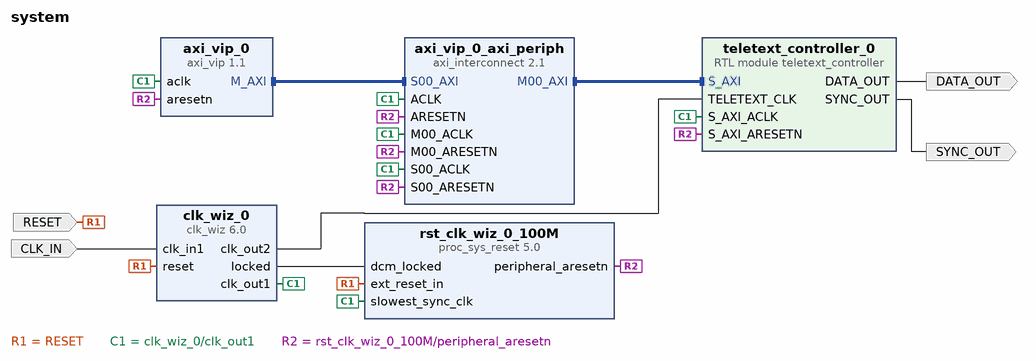
[diagram p0: block diagram of the top level]
# Vivado block design system, xc7a35tcpg236-1, Vivado 2022.2.2
create_bd_design system

create_bd_port -dir I RESET
create_bd_port -dir O -type data DATA_OUT
create_bd_port -dir O -type data SYNC_OUT
create_bd_port -dir I -type clk CLK_IN
set_property -dict {CONFIG.FREQ_HZ 100000000} [get_bd_ports CLK_IN]

create_bd_cell -type ip -vlnv xilinx.com:ip:clk_wiz:6.0 clk_wiz_0
set_property -dict [list \
  CONFIG.CLKOUT1_JITTER 135.375 \
  CONFIG.CLKOUT1_PHASE_ERROR 105.692 \
  CONFIG.CLKOUT1_REQUESTED_OUT_FREQ 100 \
  CONFIG.CLKOUT2_JITTER 231.359 \
  CONFIG.CLKOUT2_PHASE_ERROR 105.692 \
  CONFIG.CLKOUT2_REQUESTED_OUT_FREQ 6.9375 \
  CONFIG.CLKOUT2_USED true \
  CONFIG.MMCM_CLKFBOUT_MULT_F 8.875 \
  CONFIG.MMCM_CLKIN1_PERIOD 10.000 \
  CONFIG.MMCM_CLKIN2_PERIOD 10.000 \
  CONFIG.MMCM_CLKOUT0_DIVIDE_F 8.875 \
  CONFIG.MMCM_CLKOUT1_DIVIDE 128 \
  CONFIG.MMCM_DIVCLK_DIVIDE 1 \
  CONFIG.NUM_OUT_CLKS 2 \
] [get_bd_cells clk_wiz_0]
create_bd_cell -type ip -vlnv xilinx.com:ip:axi_vip:1.1 axi_vip_0
set_property -dict [list \
  CONFIG.ADDR_WIDTH 32 \
  CONFIG.DATA_WIDTH 32 \
  CONFIG.HAS_BRESP 1 \
  CONFIG.HAS_PROT 1 \
  CONFIG.HAS_RRESP 0 \
  CONFIG.HAS_WSTRB 1 \
  CONFIG.INTERFACE_MODE MASTER \
  CONFIG.PROTOCOL AXI4LITE \
  CONFIG.READ_WRITE_MODE READ_WRITE \
] [get_bd_cells axi_vip_0]
create_bd_cell -type ip -vlnv xilinx.com:ip:axi_interconnect:2.1 axi_vip_0_axi_periph
set_property -dict {CONFIG.NUM_MI 1} [get_bd_cells axi_vip_0_axi_periph]
create_bd_cell -type ip -vlnv xilinx.com:ip:proc_sys_reset:5.0 rst_clk_wiz_0_100M
create_bd_cell -type module -reference teletext_controller teletext_controller_0

# ---- connections ----

connect_bd_intf_net [get_bd_intf_pins axi_vip_0/M_AXI] [get_bd_intf_pins axi_vip_0_axi_periph/S00_AXI]
connect_bd_intf_net [get_bd_intf_pins axi_vip_0_axi_periph/M00_AXI] [get_bd_intf_pins teletext_controller_0/S_AXI]
connect_bd_net [get_bd_ports CLK_IN] [get_bd_pins clk_wiz_0/clk_in1]
connect_bd_net [get_bd_ports RESET] [get_bd_pins clk_wiz_0/reset] [get_bd_pins rst_clk_wiz_0_100M/ext_reset_in]
connect_bd_net [get_bd_pins clk_wiz_0/clk_out1] \
  [get_bd_pins axi_vip_0/aclk] [get_bd_pins axi_vip_0_axi_periph/ACLK] [get_bd_pins axi_vip_0_axi_periph/S00_ACLK] \
  [get_bd_pins rst_clk_wiz_0_100M/slowest_sync_clk] [get_bd_pins axi_vip_0_axi_periph/M00_ACLK] \
  [get_bd_pins teletext_controller_0/S_AXI_ACLK]
connect_bd_net [get_bd_pins clk_wiz_0/clk_out2] [get_bd_pins teletext_controller_0/TELETEXT_CLK]
connect_bd_net [get_bd_pins clk_wiz_0/locked] [get_bd_pins rst_clk_wiz_0_100M/dcm_locked]
connect_bd_net [get_bd_pins rst_clk_wiz_0_100M/peripheral_aresetn] \
  [get_bd_pins axi_vip_0_axi_periph/S00_ARESETN] [get_bd_pins axi_vip_0_axi_periph/M00_ARESETN] \
  [get_bd_pins axi_vip_0_axi_periph/ARESETN] [get_bd_pins axi_vip_0/aresetn] \
  [get_bd_pins teletext_controller_0/S_AXI_ARESETN]
connect_bd_net [get_bd_pins teletext_controller_0/DATA_OUT] [get_bd_ports DATA_OUT]
connect_bd_net [get_bd_pins teletext_controller_0/SYNC_OUT] [get_bd_ports SYNC_OUT]

# ---- address map ----
assign_bd_address -offset 0x00000000 -range 128 -target_address_space [get_bd_addr_spaces axi_vip_0/Master_AXI] [get_bd_addr_segs teletext_controller_0/S_AXI/reg0]

validate_bd_design
save_bd_design
